# Altium schematic sheet Block Diagram.SchDoc: EEG Measurement Circuit
size A3; Date: 24/01/2025; DrawnBy: Giang Phan Truong; Revision: 1.1.0; SheetNumber: 1; SheetTotal: 7
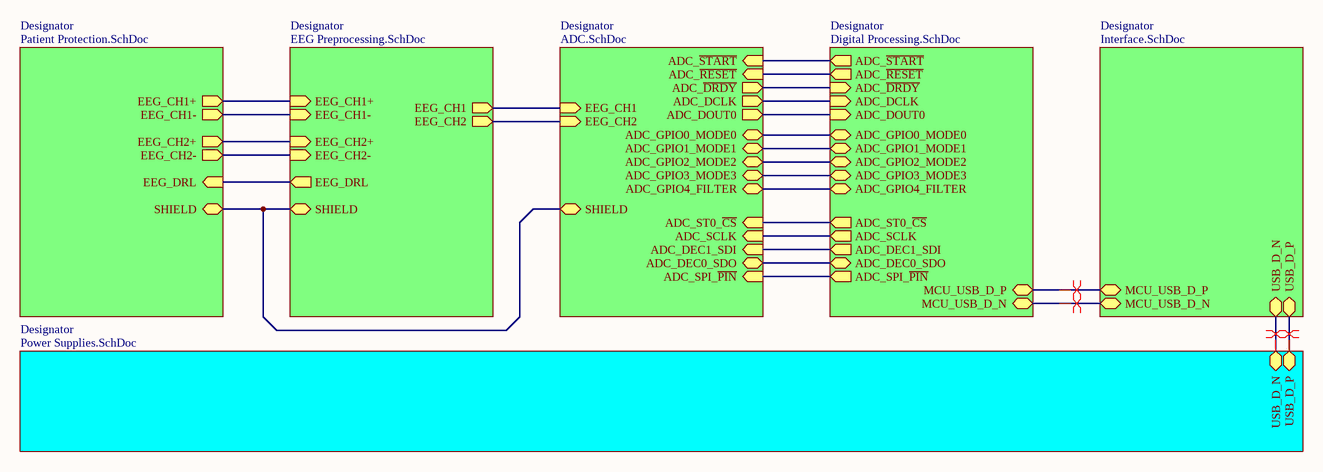
[diagram p0: Block Diagram.SchDoc]

## Sub-sheets
Designator = Power Supplies.SchDoc: USB_D_N (bidir), USB_D_P (bidir)
Designator = EEG Preprocessing.SchDoc: EEG_CH1+ (in), EEG_CH1- (in), EEG_CH2+ (in), EEG_CH2- (in), EEG_CH1 (out), EEG_CH2 (out), EEG_DRL (out), SHIELD (bidir)
Designator = ADC.SchDoc: EEG_CH2 (in), EEG_CH1 (in), SHIELD (bidir), ADC_GPIO0_MODE0 (bidir), ADC_GPIO1_MODE1 (bidir), ADC_GPIO2_MODE2 (bidir), ADC_GPIO3_MODE3 (bidir), ADC_GPIO4_FILTER (bidir), ADC_ST0_~{CS} (in), ADC_SCLK (in), ADC_DEC1_SDI (in), ADC_DEC0_SDO (bidir), ADC_SPI_~{PIN} (in), ADC_~{START} (in), ADC_~{RESET} (in), ADC_~{DRDY} (out), ADC_DCLK (out), ADC_DOUT0 (out)
Designator = Digital Processing.SchDoc: ADC_GPIO0_MODE0 (bidir), ADC_GPIO1_MODE1 (bidir), ADC_GPIO2_MODE2 (bidir), ADC_GPIO3_MODE3 (bidir), ADC_GPIO4_FILTER (bidir), ADC_ST0_~{CS} (out), ADC_SCLK (out), ADC_DEC1_SDI (out), ADC_DEC0_SDO (bidir), ADC_SPI_~{PIN} (out), ADC_~{START} (out), ADC_~{RESET} (out), ADC_~{DRDY} (in), ADC_DCLK (in), ADC_DOUT0 (in), MCU_USB_D_P (bidir), MCU_USB_D_N (bidir)
Designator = Interface.SchDoc: USB_D_P (bidir), USB_D_N (bidir), MCU_USB_D_P (bidir), MCU_USB_D_N (bidir)
Designator = Patient Protection.SchDoc: EEG_CH1+ (out), EEG_CH1- (out), EEG_CH2- (out), EEG_CH2+ (out), EEG_DRL (in), SHIELD (bidir)

## Nets
(unnamed): sheet Designator/USB_D_N, sheet Designator/USB_D_N
(unnamed): sheet Designator/USB_D_P, sheet Designator/USB_D_P
(unnamed): sheet Designator/EEG_CH1+, sheet Designator/EEG_CH1+
(unnamed): sheet Designator/EEG_CH1-, sheet Designator/EEG_CH1-
(unnamed): sheet Designator/EEG_CH2+, sheet Designator/EEG_CH2+
(unnamed): sheet Designator/EEG_CH2-, sheet Designator/EEG_CH2-
(unnamed): sheet Designator/EEG_CH1, sheet Designator/EEG_CH1
(unnamed): sheet Designator/EEG_CH2, sheet Designator/EEG_CH2
(unnamed): sheet Designator/EEG_DRL, sheet Designator/EEG_DRL
(unnamed): sheet Designator/SHIELD, sheet Designator/SHIELD, sheet Designator/SHIELD
(unnamed): sheet Designator/ADC_GPIO0_MODE0, sheet Designator/ADC_GPIO0_MODE0
(unnamed): sheet Designator/ADC_GPIO1_MODE1, sheet Designator/ADC_GPIO1_MODE1
(unnamed): sheet Designator/ADC_GPIO2_MODE2, sheet Designator/ADC_GPIO2_MODE2
(unnamed): sheet Designator/ADC_GPIO3_MODE3, sheet Designator/ADC_GPIO3_MODE3
(unnamed): sheet Designator/ADC_GPIO4_FILTER, sheet Designator/ADC_GPIO4_FILTER
(unnamed): sheet Designator/ADC_ST0_~{CS}, sheet Designator/ADC_ST0_~{CS}
(unnamed): sheet Designator/ADC_SCLK, sheet Designator/ADC_SCLK
(unnamed): sheet Designator/ADC_DEC1_SDI, sheet Designator/ADC_DEC1_SDI
(unnamed): sheet Designator/ADC_DEC0_SDO, sheet Designator/ADC_DEC0_SDO
(unnamed): sheet Designator/ADC_SPI_~{PIN}, sheet Designator/ADC_SPI_~{PIN}
(unnamed): sheet Designator/ADC_~{START}, sheet Designator/ADC_~{START}
(unnamed): sheet Designator/ADC_~{RESET}, sheet Designator/ADC_~{RESET}
(unnamed): sheet Designator/ADC_~{DRDY}, sheet Designator/ADC_~{DRDY}
(unnamed): sheet Designator/ADC_DCLK, sheet Designator/ADC_DCLK
(unnamed): sheet Designator/ADC_DOUT0, sheet Designator/ADC_DOUT0
(unnamed): sheet Designator/MCU_USB_D_P, sheet Designator/MCU_USB_D_P
(unnamed): sheet Designator/MCU_USB_D_N, sheet Designator/MCU_USB_D_N

## Layout directives
differential pair: (no net found under the mark)

## Notes on the sheet
- Project Name:
- Size
- Size:
- A3
- Revision:
- Drawn By:
- Date:
- File:
- Last Modified:
- Checked By:
- Sheet
- of